# EAGLE design camera_module (EAGLE 9.2.2)
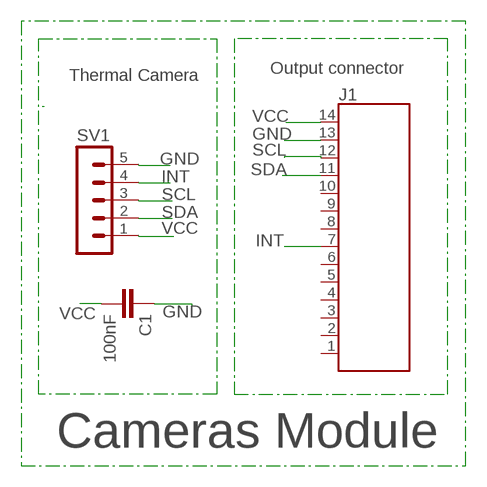
[diagram p0: schematic, sheet 1]

## Parts
C1  100nF  C-EUC0805  [C0805]
J1  686114183522  [686114183522]
SV1  MA05-1  [MA05-1]

## Nets
GND: C1.1 J1.13 SV1.5
INT: J1.7 SV1.4
SCL: J1.12 SV1.3
SDA: J1.11 SV1.2
VCC: C1.2 J1.14 SV1.1
Unconnected: J1.1 J1.2 J1.3 J1.4 J1.5 J1.6 J1.8 J1.9 J1.10

## Notes on the sheet
- Output connector
- Thermal Camera
- Cameras Module

## Library data of the parts
C1 = rcl:C-EU: CAPACITOR, European symbol; SPICEPREFIX: C
J1 = Wurth_Elektronik_Electromechanic_FPC_Connectors_&_Flat_Flexible_Cable_rev18c:686114183522: 686114183522 WR-FPC 1.00mm SMT Horizontal Bottom Contact - Low Profile <http://katalog.we-online.de/media/images/v2/Family_WR-FPC_6861xx183522.jpg> Details see: http://katalog.we-online.de/en/em/FPC_1_00_SMT_ZIF_HORIZONTAL_BOTTOM_CONTACT_LOW_PROFILE_6861xx183522 Created by Yingchun,shan 2016 (C) Wurth Elektronik
SV1 = con-lstb:MA05-1: PIN HEADER; OC_FARNELL: unknown; OC_NEWARK: unknown

## Board
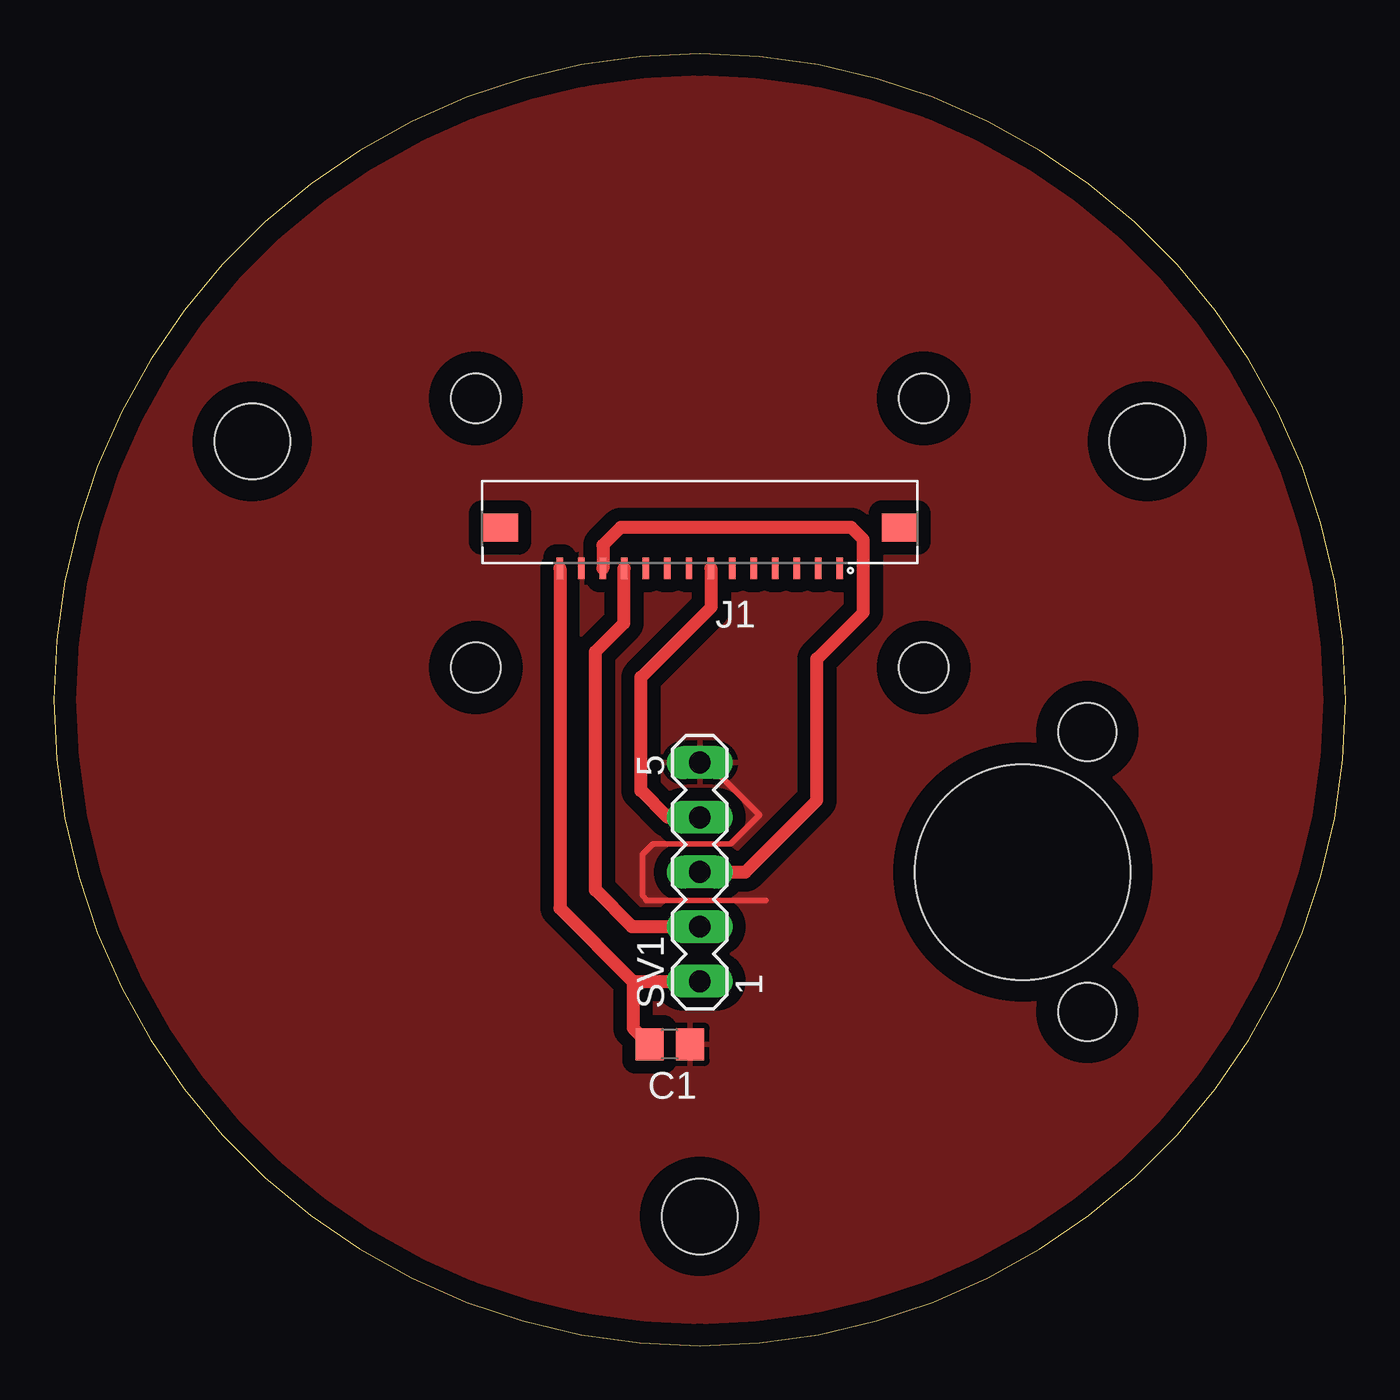
[diagram p1: board, top side]

Size 60 x 60 mm. Coordinates in mm from the lower left corner, seen from the top.
Outline: 0,30 arc90 30,0 arc90 60,30 arc90 30,60 arc90 0,30
Copper layers (1*16): Top 0.035mm / dielectric 1.5mm / Bottom 0.035mm
Design rules "default *": minimum track width 8mil, minimum drill 0.3mm, track to track 8mil, track to pad 8mil, pad to pad 8mil, via to via 8mil, smd to smd 8mil, copper to edge 40mil, drill to drill 6mil, minimum pad ring 10mil, minimum via ring 8mil, stop-mask expansion 4mil, vias tented up to drill 0mil, thermal gap 10mil
Holes 2.7 mm at 48,28.5 48,15.5
Holes 10 mm at 45,22
Holes 3.5 mm at 30,6 50.78,42 9.22,42
Holes 2.3 mm at 19.6,44 40.4,44 19.6,31.5 40.4,31.5

### Footprints (pad centres in the part's own frame; a part is rotated, then mirrored left to right if it is on the bottom)
C0805 = smd 1.3 x 1.5: 1 -0.95,0; 2 0.95,0
686114183522 = smd 0.3 x 1: 1 -6.5,1.9; 2 -5.5,1.9; 3 -4.5,1.9; 4 -3.5,1.9; 5 -2.5,1.9; 6 -1.5,1.9; 7 -0.5,1.9; 8 0.5,1.9; 9 1.5,1.9; 10 2.5,1.9; 11 3.5,1.9; 12 4.5,1.9; 13 5.5,1.9; 14 6.5,1.9 | smd 1.65 x 1.3: Z1 -9.275,0; Z2 9.275,0
MA05-1 = drill 1.016 long: 1 -5.08,0; 2 -2.54,0; 3 0,0; 4 2.54,0; 5 5.08,0

### Placement (x,y rotation side)
C1  28.61,14 180 top
J1  30,38 180 top
SV1  30,22 90 top

### Tracks (layer width: path | path; a pad name or v marks a point on that pad's centre or on a via)
GND
  Top 0.254: SV1.5 30.33,27.08 32.77,24.64 31.43,23.29 27.82,23.29 27.34,22.81 27.34,20.9 27.52,20.73 27.52,20.68 33.08,20.68
  pour Top (isolate 0.61): -7.18,66.57 -7.18,-1.75 -4.34,-4.6 56.8,-4.6 71.66,10.26 71.66,63.07 63.18,71.55 -1.16,71.55 -2.94,69.77
INT
  Top 0.61: SV1.4 28.5,24.54 27.26,25.78 27.26,31.04 30.54,34.31 30.54,36.06 J1.7
SCL
  Top 0.61: SV1.3 32.12,22 35.44,25.32 35.44,31.9 37.6,34.06 37.6,37.44 37.04,38 26.32,38 25.5,37.18 J1.12
SDA
  Top 0.61: SV1.2 26.85,19.46 25.15,21.16 25.15,32.23 26.47,33.55 26.47,36.07 J1.11
VCC
  Top 0.61: J1.14 23.5,20.32 26.91,16.92 | 26.91,16.92 SV1.1 | 26.91,16.92 26.91,14.75 C1.2